# EAGLE design analogmic (EAGLE 9.2.2)
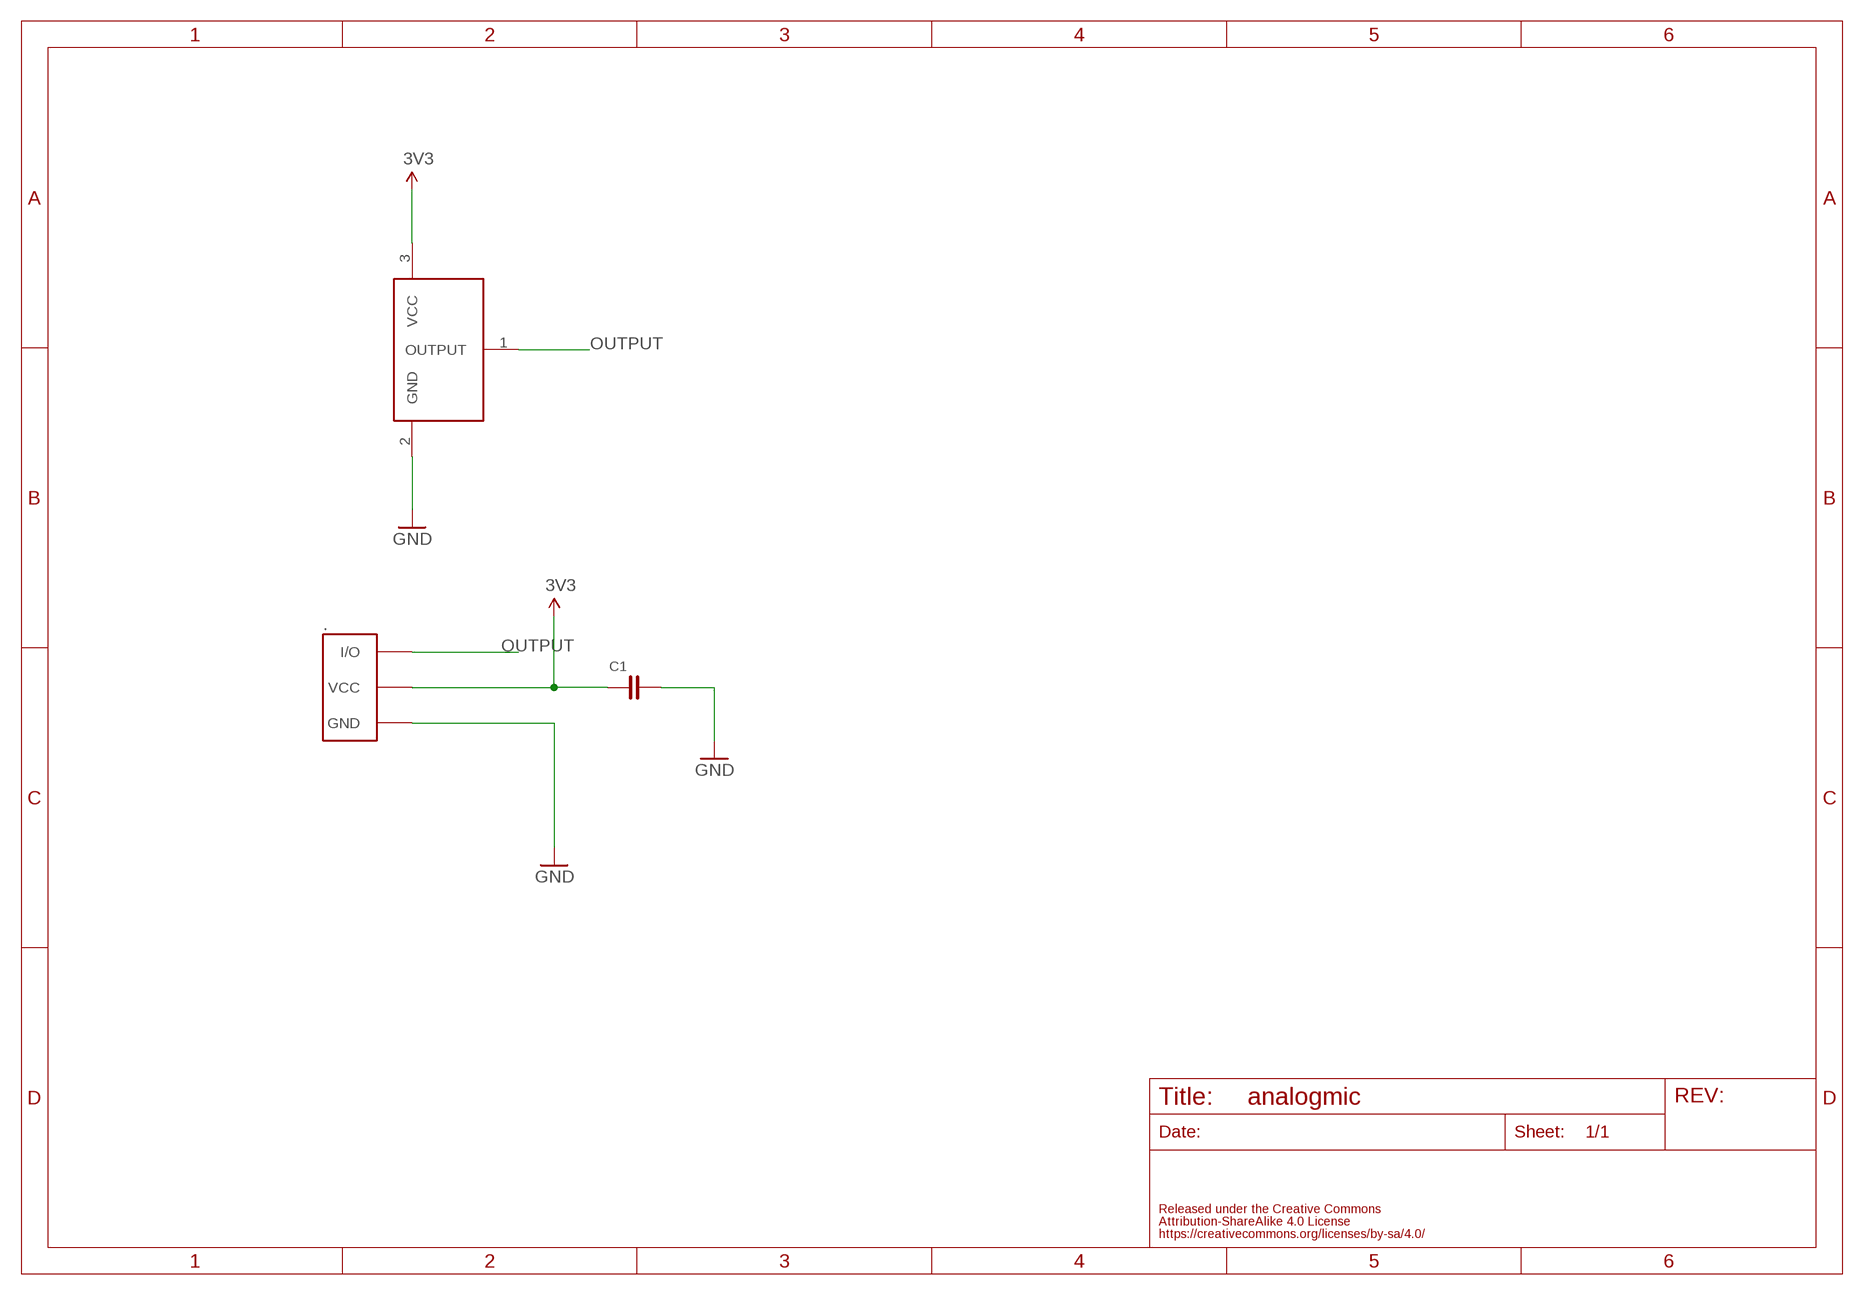
[diagram p0: schematic, sheet 1]

## Parts
.  FABO_BRICK_3PIN-S03B-PASK-2  [FABO_BRICK_3PIN_S03B-PASK-2]
C1  CAPACITOR-0603  [0603]
ICS-40310  ANALOG-MIC  [ICS40310]

## Nets
3V3: ..VCC C1.1 ICS-40310.3(VCC)
GND: ..GND C1.2 ICS-40310.2(GND)
OUTPUT: ..I/O ICS-40310.1(OUTPUT)

## Library data of the parts
. = FaBo-Template:FABO_BRICK_3PIN: FaBo Brick 3pin
C1 = FaBo-Capacitor:CAPACITOR: CAPACITOR
ICS-40310 = FaBo-Sound:ANALOG-MIC

## Board
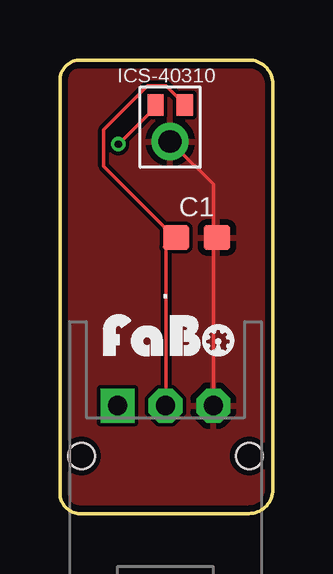
[diagram p1: board, top side]
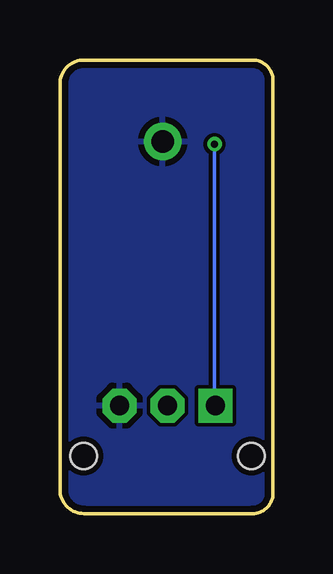
[diagram p2: board, bottom side, seen from below]

Size 8.89 x 18.9 mm. Coordinates in mm from the lower left corner, seen from the top.
Outline: 0,0.85 0,18.05 arc-90 0.85,18.9 7.88,18.9 arc-90 8.89,17.89 8.89,1.01 arc-90 7.88,0 0.85,0 arc-90 0,0.85
Copper layers (1*16): Top 0.035mm / dielectric 1.5mm / Bottom 0.035mm
Design rules "SeeedStudio_2layer_DRU_no_angle_20140221": minimum track width 6mil, minimum drill 12mil, track to track 6mil, track to pad 6mil, pad to pad 6mil, via to via 6mil, smd to smd 0mil, copper to edge 10mil, drill to drill 10mil, minimum pad ring 10mil, minimum via ring 6mil, stop-mask expansion 2mil, vias tented up to drill 100mil, thermal gap 10mil

### Footprints (pad centres in the part's own frame; a part is rotated, then mirrored left to right if it is on the bottom)
FABO_BRICK_3PIN_S03B-PASK-2 = drill 0.8 pad 1.422 octagon: GND -2,0; VCC 0,0 | drill 0.8 pad 1.422 square: I/O 2,0 | hole 1.1: 3.5,2.1; -3.5,2.1
0603 = smd 1.1 x 1: 1 -0.85,0; 2 0.85,0
ICS40310 = smd 0.68 x 0.9: 1 -0.61,0.92; 3 0.61,0.92 | drill 0.95 pad 1.55: 2 0,-0.6

### Placement (x,y rotation side)
.  4.4,4.5 180 top
C1  5.7,11.5 0 top
ICS-40310  4.6,16.1 0 top
U$2  [LOGO_FABO_S]  4.6,6.4 0 top

### Tracks (layer width: path | path; a pad name or v marks a point on that pad's centre or on a via)
3V3
  Top 0.152: ICS-40310.3 5.18,17.07 4.42,17.83 3.66,17.83 1.83,16 1.83,14.48 4.72,11.58 C1.1 4.72,11.43 4.42,11.12 4.42,4.57 ..VCC
GND
  Top 0.152: ICS-40310.2 4.72,15.39 6.4,13.72 6.4,11.58 C1.2 6.4,11.43 6.4,4.57 ..GND
  pour Top: 0,0 0,19.05 8.89,19.05 8.89,0
  pour Bottom: 0,0 0,19.05 8.89,19.05 8.89,0
OUTPUT  (via drill 0.3)
  Top 0.152: v2.44,15.39 3.96,16.92 ICS-40310.1
  Bottom 0.152: v2.44,15.39 2.44,4.57 ..I/O